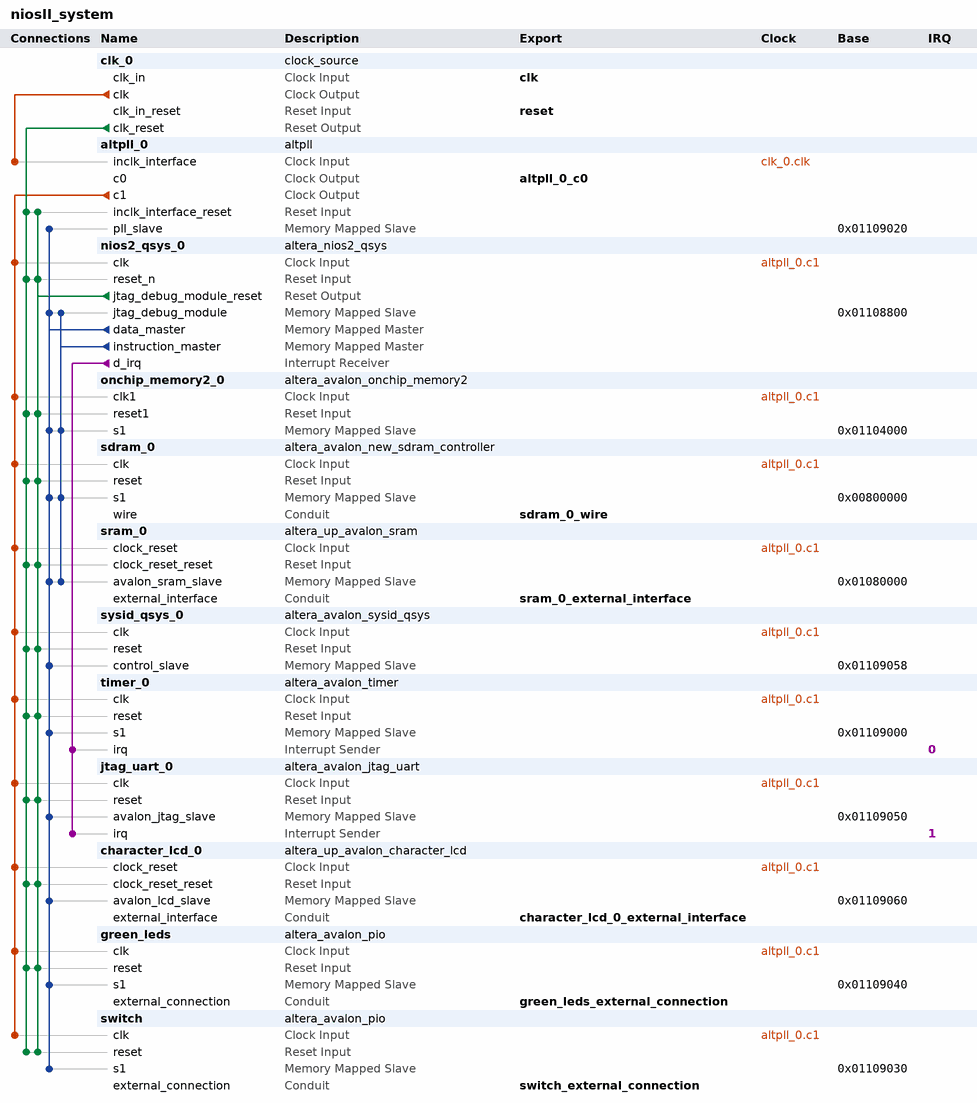
[diagram p0: system contents]
# Platform Designer (Qsys) system niosII_system, Cyclone II EP2C35F672C6
# Parameters at their usual value, and those the tool derives, are not listed.
package require -exact qsys 12.1
create_system niosII_system
set_project_property DEVICE_FAMILY {Cyclone II}
set_project_property DEVICE EP2C35F672C6

add_instance clk_0 clock_source 12.1
set_instance_parameter_value clk_0 clockFrequency 50000000

add_instance altpll_0 altpll 12.1
set_instance_parameter_value altpll_0 INCLK0_INPUT_FREQUENCY 20000
set_instance_parameter_value altpll_0 GATE_LOCK_SIGNAL NO
set_instance_parameter_value altpll_0 VALID_LOCK_MULTIPLIER 1
set_instance_parameter_value altpll_0 INVALID_LOCK_MULTIPLIER 5
set_instance_parameter_value altpll_0 CLK0_MULTIPLY_BY 1
set_instance_parameter_value altpll_0 CLK1_MULTIPLY_BY 1
set_instance_parameter_value altpll_0 CLK0_DIVIDE_BY 1
set_instance_parameter_value altpll_0 CLK1_DIVIDE_BY 1
set_instance_parameter_value altpll_0 CLK0_PHASE_SHIFT -167
set_instance_parameter_value altpll_0 CLK1_PHASE_SHIFT 0
set_instance_parameter_value altpll_0 CLK1_DUTY_CYCLE 50
set_instance_parameter_value altpll_0 PORT_clk1 PORT_USED
set_instance_parameter_value altpll_0 PORT_clk2 PORT_UNUSED
set_instance_parameter_value altpll_0 PORT_clk3 PORT_UNUSED
set_instance_parameter_value altpll_0 PORT_ARESET PORT_UNUSED
set_instance_parameter_value altpll_0 PORT_LOCKED PORT_UNUSED

add_instance nios2_qsys_0 altera_nios2_qsys 12.1
set_instance_parameter_value nios2_qsys_0 resetSlave onchip_memory2_0.s1
set_instance_parameter_value nios2_qsys_0 exceptionSlave onchip_memory2_0.s1
set_instance_parameter_value nios2_qsys_0 breakSlave nios2_qsys_0.jtag_debug_module
set_instance_parameter_value nios2_qsys_0 impl Tiny
set_instance_parameter_value nios2_qsys_0 icache_size 4096

add_instance onchip_memory2_0 altera_avalon_onchip_memory2 12.1
set_instance_parameter_value onchip_memory2_0 dataWidth 32
set_instance_parameter_value onchip_memory2_0 dualPort false
set_instance_parameter_value onchip_memory2_0 initMemContent true
set_instance_parameter_value onchip_memory2_0 initializationFileName onchip_memory2_0
set_instance_parameter_value onchip_memory2_0 memorySize 16384

add_instance sdram_0 altera_avalon_new_sdram_controller 12.1
set_instance_parameter_value sdram_0 TAC 5.5
set_instance_parameter_value sdram_0 TRCD 20.0
set_instance_parameter_value sdram_0 TRP 20.0
set_instance_parameter_value sdram_0 casLatency 3
set_instance_parameter_value sdram_0 columnWidth 8
set_instance_parameter_value sdram_0 dataWidth 16
set_instance_parameter_value sdram_0 generateSimulationModel false
set_instance_parameter_value sdram_0 model custom
set_instance_parameter_value sdram_0 numberOfBanks 4
set_instance_parameter_value sdram_0 numberOfChipSelects 1
set_instance_parameter_value sdram_0 powerUpDelay 100.0
set_instance_parameter_value sdram_0 refreshPeriod 15.625
set_instance_parameter_value sdram_0 rowWidth 12

add_instance sram_0 altera_up_avalon_sram 12.0
set_instance_parameter_value sram_0 board DE2
set_instance_parameter_value sram_0 pixel_buffer false

add_instance sysid_qsys_0 altera_avalon_sysid_qsys 12.1
set_instance_parameter_value sysid_qsys_0 id 0

add_instance timer_0 altera_avalon_timer 12.1
set_instance_parameter_value timer_0 period 1
set_instance_parameter_value timer_0 periodUnits MSEC
set_instance_parameter_value timer_0 timerPreset CUSTOM

add_instance jtag_uart_0 altera_avalon_jtag_uart 12.1
set_instance_parameter_value jtag_uart_0 simInteractiveOptions INTERACTIVE_INPUT_OUTPUT

add_instance character_lcd_0 altera_up_avalon_character_lcd 12.0
set_instance_parameter_value character_lcd_0 cursor Normal

add_instance green_leds altera_avalon_pio 12.1
set_instance_parameter_value green_leds direction Output
set_instance_parameter_value green_leds width 8

add_instance switch altera_avalon_pio 12.1
set_instance_parameter_value switch direction Input
set_instance_parameter_value switch width 1

# connections
add_connection altpll_0.c1 character_lcd_0.clock_reset clock
add_connection altpll_0.c1 green_leds.clk clock
add_connection altpll_0.c1 jtag_uart_0.clk clock
add_connection altpll_0.c1 nios2_qsys_0.clk clock
add_connection altpll_0.c1 onchip_memory2_0.clk1 clock
add_connection altpll_0.c1 sdram_0.clk clock
add_connection altpll_0.c1 sram_0.clock_reset clock
add_connection altpll_0.c1 switch.clk clock
add_connection altpll_0.c1 sysid_qsys_0.clk clock
add_connection altpll_0.c1 timer_0.clk clock
add_connection clk_0.clk altpll_0.inclk_interface clock
add_connection clk_0.clk_reset altpll_0.inclk_interface_reset reset
add_connection clk_0.clk_reset character_lcd_0.clock_reset_reset reset
add_connection clk_0.clk_reset green_leds.reset reset
add_connection clk_0.clk_reset jtag_uart_0.reset reset
add_connection clk_0.clk_reset nios2_qsys_0.reset_n reset
add_connection clk_0.clk_reset onchip_memory2_0.reset1 reset
add_connection clk_0.clk_reset sdram_0.reset reset
add_connection clk_0.clk_reset sram_0.clock_reset_reset reset
add_connection clk_0.clk_reset switch.reset reset
add_connection clk_0.clk_reset sysid_qsys_0.reset reset
add_connection clk_0.clk_reset timer_0.reset reset
add_connection nios2_qsys_0.jtag_debug_module_reset altpll_0.inclk_interface_reset reset
add_connection nios2_qsys_0.jtag_debug_module_reset character_lcd_0.clock_reset_reset reset
add_connection nios2_qsys_0.jtag_debug_module_reset green_leds.reset reset
add_connection nios2_qsys_0.jtag_debug_module_reset jtag_uart_0.reset reset
add_connection nios2_qsys_0.jtag_debug_module_reset nios2_qsys_0.reset_n reset
add_connection nios2_qsys_0.jtag_debug_module_reset onchip_memory2_0.reset1 reset
add_connection nios2_qsys_0.jtag_debug_module_reset sdram_0.reset reset
add_connection nios2_qsys_0.jtag_debug_module_reset sram_0.clock_reset_reset reset
add_connection nios2_qsys_0.jtag_debug_module_reset switch.reset reset
add_connection nios2_qsys_0.jtag_debug_module_reset sysid_qsys_0.reset reset
add_connection nios2_qsys_0.jtag_debug_module_reset timer_0.reset reset
add_connection nios2_qsys_0.data_master altpll_0.pll_slave avalon
set_connection_parameter_value nios2_qsys_0.data_master/altpll_0.pll_slave baseAddress 0x01109020
add_connection nios2_qsys_0.data_master character_lcd_0.avalon_lcd_slave avalon
set_connection_parameter_value nios2_qsys_0.data_master/character_lcd_0.avalon_lcd_slave baseAddress 0x01109060
add_connection nios2_qsys_0.data_master green_leds.s1 avalon
set_connection_parameter_value nios2_qsys_0.data_master/green_leds.s1 baseAddress 0x01109040
add_connection nios2_qsys_0.data_master jtag_uart_0.avalon_jtag_slave avalon
set_connection_parameter_value nios2_qsys_0.data_master/jtag_uart_0.avalon_jtag_slave baseAddress 0x01109050
add_connection nios2_qsys_0.data_master nios2_qsys_0.jtag_debug_module avalon
set_connection_parameter_value nios2_qsys_0.data_master/nios2_qsys_0.jtag_debug_module baseAddress 0x01108800
add_connection nios2_qsys_0.data_master onchip_memory2_0.s1 avalon
set_connection_parameter_value nios2_qsys_0.data_master/onchip_memory2_0.s1 baseAddress 0x01104000
add_connection nios2_qsys_0.data_master sdram_0.s1 avalon
set_connection_parameter_value nios2_qsys_0.data_master/sdram_0.s1 baseAddress 0x00800000
add_connection nios2_qsys_0.data_master sram_0.avalon_sram_slave avalon
set_connection_parameter_value nios2_qsys_0.data_master/sram_0.avalon_sram_slave baseAddress 0x01080000
add_connection nios2_qsys_0.data_master switch.s1 avalon
set_connection_parameter_value nios2_qsys_0.data_master/switch.s1 baseAddress 0x01109030
add_connection nios2_qsys_0.data_master sysid_qsys_0.control_slave avalon
set_connection_parameter_value nios2_qsys_0.data_master/sysid_qsys_0.control_slave baseAddress 0x01109058
add_connection nios2_qsys_0.data_master timer_0.s1 avalon
set_connection_parameter_value nios2_qsys_0.data_master/timer_0.s1 baseAddress 0x01109000
add_connection nios2_qsys_0.instruction_master nios2_qsys_0.jtag_debug_module avalon
set_connection_parameter_value nios2_qsys_0.instruction_master/nios2_qsys_0.jtag_debug_module baseAddress 0x01108800
add_connection nios2_qsys_0.instruction_master onchip_memory2_0.s1 avalon
set_connection_parameter_value nios2_qsys_0.instruction_master/onchip_memory2_0.s1 baseAddress 0x01104000
add_connection nios2_qsys_0.instruction_master sdram_0.s1 avalon
set_connection_parameter_value nios2_qsys_0.instruction_master/sdram_0.s1 baseAddress 0x00800000
add_connection nios2_qsys_0.instruction_master sram_0.avalon_sram_slave avalon
set_connection_parameter_value nios2_qsys_0.instruction_master/sram_0.avalon_sram_slave baseAddress 0x01080000
add_connection nios2_qsys_0.d_irq jtag_uart_0.irq interrupt
set_connection_parameter_value nios2_qsys_0.d_irq/jtag_uart_0.irq irqNumber 1
add_connection nios2_qsys_0.d_irq timer_0.irq interrupt
set_connection_parameter_value nios2_qsys_0.d_irq/timer_0.irq irqNumber 0

# exported interfaces
add_interface clk clock sink
set_interface_property clk EXPORT_OF clk_0.clk_in
add_interface reset reset sink
set_interface_property reset EXPORT_OF clk_0.clk_in_reset
add_interface character_lcd_0_external_interface conduit end
set_interface_property character_lcd_0_external_interface EXPORT_OF character_lcd_0.external_interface
add_interface green_leds_external_connection conduit end
set_interface_property green_leds_external_connection EXPORT_OF green_leds.external_connection
add_interface switch_external_connection conduit end
set_interface_property switch_external_connection EXPORT_OF switch.external_connection
add_interface altpll_0_c0 clock source
set_interface_property altpll_0_c0 EXPORT_OF altpll_0.c0
add_interface sdram_0_wire conduit end
set_interface_property sdram_0_wire EXPORT_OF sdram_0.wire
add_interface sram_0_external_interface conduit end
set_interface_property sram_0_external_interface EXPORT_OF sram_0.external_interface

save_system niosII_system.qsys
